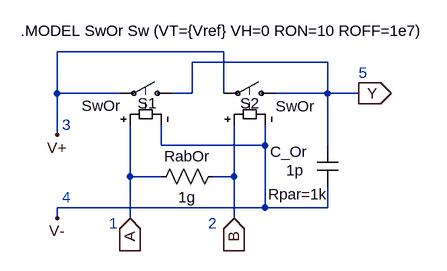
[diagram p0: schematic OrH.asc]
OrH.asc, the LTspice schematic file:
Version 4
SHEET 1 880 680
WIRE -112 224 -112 160
WIRE -112 288 -112 224
WIRE -112 416 -112 400
WIRE -16 224 -112 224
WIRE 0 352 0 272
WIRE 0 416 0 352
WIRE 48 304 48 272
WIRE 48 352 0 352
WIRE 96 224 64 224
WIRE 96 224 96 176
WIRE 144 160 -112 160
WIRE 144 224 144 160
WIRE 160 352 128 352
WIRE 160 352 160 272
WIRE 160 416 160 352
WIRE 208 304 48 304
WIRE 208 304 208 272
WIRE 208 400 -112 400
WIRE 208 400 208 304
WIRE 304 176 96 176
WIRE 304 224 224 224
WIRE 304 224 304 176
WIRE 304 304 304 224
WIRE 304 400 208 400
WIRE 304 400 304 368
WIRE 352 224 304 224
FLAG 352 224 Y
IOPIN 352 224 Out
FLAG 0 416 A
IOPIN 0 416 In
FLAG 160 416 B
IOPIN 160 416 In
FLAG -112 416 V-
FLAG -112 288 V+
SYMBOL sw 80 224 M270
WINDOW 0 -15 39 VRight 0
WINDOW 3 -19 94 VRight 0
SYMATTR InstName S1
SYMATTR Value SwOr
SYMBOL sw 240 224 M270
WINDOW 0 -15 41 VRight 0
WINDOW 3 -20 -44 VRight 0
SYMATTR InstName S2
SYMATTR Value SwOr
SYMBOL res 144 336 R90
WINDOW 0 0 56 VBottom 0
WINDOW 3 32 56 VTop 0
SYMATTR InstName RabOr
SYMATTR Value 1g
SYMBOL cap 288 304 R0
WINDOW 0 -72 10 Left 0
WINDOW 3 -48 38 Left 0
WINDOW 39 -75 75 Left 0
SYMATTR InstName C_Or
SYMATTR Value 1p
SYMATTR SpiceLine Rpar=1k
TEXT -32 424 Left 0 ;1
TEXT 120 424 Left 0 ;2
TEXT 352 192 Left 0 ;5
TEXT -168 128 Left 0 !.MODEL SwOr Sw (VT={Vref} VH=0 RON=10 ROFF=1e7)
TEXT -104 272 Left 0 ;3
TEXT -104 384 Left 0 ;4

The netlist it stands for:
* OrH.asc
S1 Y V+ A V- SwOr
S2 Y V+ B V- SwOr
RabOr B A 1g
C_Or Y V- 1p Rpar=1k
* 1
* 2
* 5
.MODEL SwOr Sw (VT={Vref} VH=0 RON=10 ROFF=1e7)
* 3
* 4
.backanno
.end